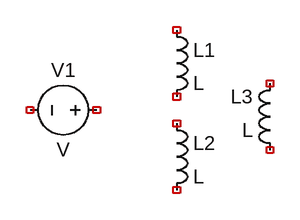
[diagram p0: schematic Draft1.asc]
Draft1.asc, the LTspice schematic file:
Version 4
SHEET 1 880 680
SYMBOL ind 256 48 R0
SYMATTR InstName L1
SYMBOL ind 256 160 R0
SYMATTR InstName L2
SYMBOL ind 400 224 R180
WINDOW 0 36 80 Left 2
WINDOW 3 36 40 Left 2
SYMATTR InstName L3
SYMBOL voltage 192 160 R90
WINDOW 0 -32 56 VBottom 2
WINDOW 3 32 56 VTop 2
SYMATTR InstName V1

The netlist it stands for:
* Draft1.asc
L1 NC_01 NC_02 L
L2 NC_03 NC_04 L
L3 NC_05 NC_06 L
V1 NC_07 NC_08 V
.backanno
.end